# EAGLE design main_card_relay (EAGLE 6.3)
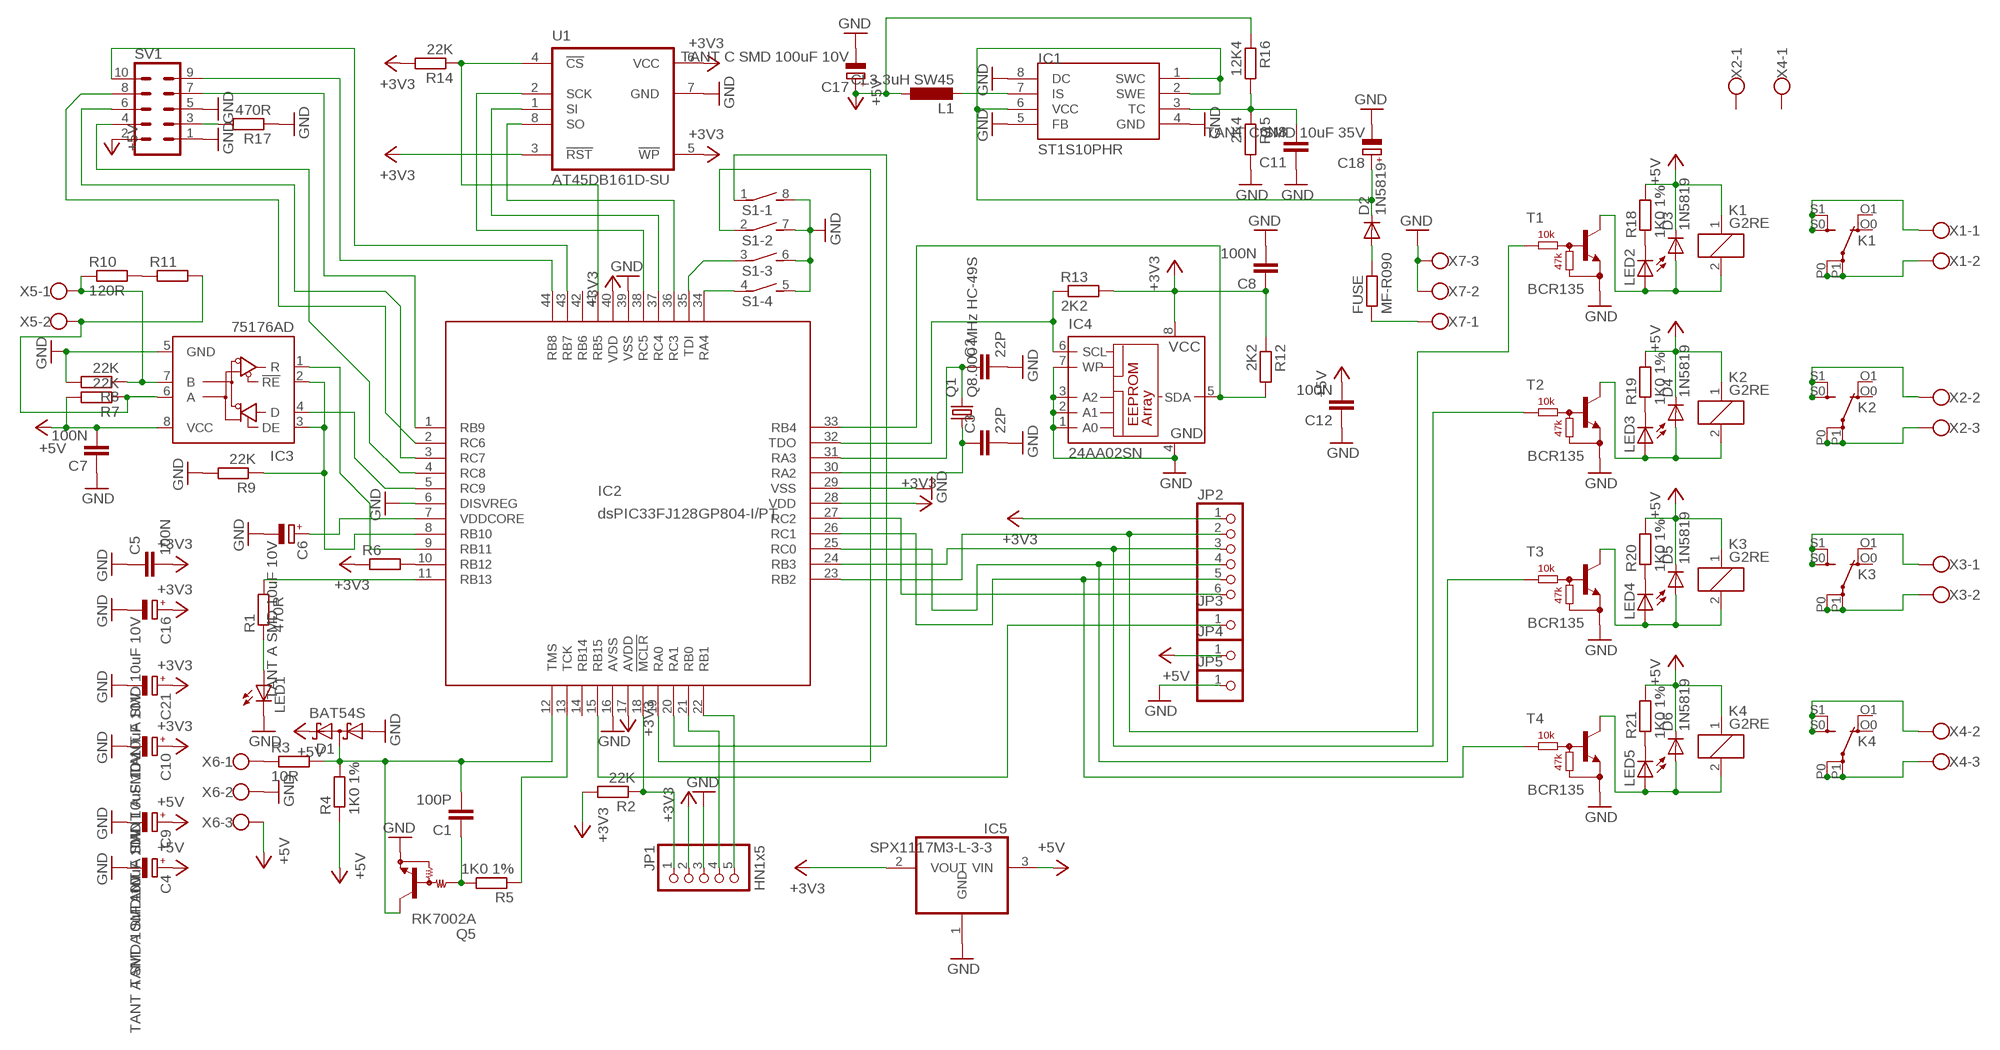
[diagram p0: schematic, sheet 1]

## Parts
C1  100P  C-EUC0805  [C0805]
C2  22P  C-EUC0805  [C0805]
C3  22P  C-EUC0805  [C0805]
C4  TANT A SMD 10uF 10V  CPOL-EUSMCA  [SMC_A]
C5  100N  C-EUC0805  [C0805]
C6  TANT A SMD 10uF 10V  CPOL-EUSMCA  [SMC_A]
C7  100N  C-EUC0805  [C0805]
C8  100N  C-EUC0805  [C0805]
C9  TANT A SMD 10uF 10V  CPOL-EUSMCA  [SMC_A]
C10  TANT A SMD 10uF 10V  CPOL-EUSMCA  [SMC_A]
C11  6N8  C-EUC0805  [C0805]
C12  100N  C-EUC0805  [C0805]
C16  TANT A SMD 10uF 10V  CPOL-EUSMCA  [SMC_A]
C17  TANT C SMD 100uF 10V  CPOL-EUSMCC  [SMC_C]
C18  TANT C SMD 10uF 35V  CPOL-EUSMCC  [SMC_C]
C21  TANT A SMD 10uF 10V  CPOL-EUSMCA  [SMC_A]
D1  BAT54S  BAS40-04  [SOT23]
D2  1N5819  DIODE-DO214AC  [DO214AC]
D3  1N5819  DIODE-DO214AC  [DO214AC]
D4  1N5819  DIODE-DO214AC  [DO214AC]
D5  1N5819  DIODE-DO214AC  [DO214AC]
D6  1N5819  DIODE-DO214AC  [DO214AC]
FUSE  MF-R090  R-EU_0204/2V  [0204V]
IC1  ST1S10PHR  MC34063AD  [SOIC8]
IC2  dsPIC33FJ128GP804-I/PT  PIC24FJ64GA004  [TQFP44]
IC3  75176AD  [D_R-PDSO-G8]
IC4  24AA02SN  [SO-08]
IC5  SPX1117M3-L-3-3  REG1117  [SOT223]
JP1  HN1x5  PINHD-1X5  [1X05]
JP2  PINHD-1X6  [1X06]
JP3  PINHD-1X1  [1X01]
JP4  PINHD-1X1  [1X01]
JP5  PINHD-1X1  [1X01]
K1  G2RE  [G2RE]
K2  G2RE  [G2RE]
K3  G2RE  [G2RE]
K4  G2RE  [G2RE]
L1  CL3.3uH SW45  L-EU0207/2V  [0207/2V]
LED1  LEDCHIPLED_1206  [CHIPLED_1206]
LED2  LEDCHIPLED_1206  [CHIPLED_1206]
LED3  LEDCHIPLED_1206  [CHIPLED_1206]
LED4  LEDCHIPLED_1206  [CHIPLED_1206]
LED5  LEDCHIPLED_1206  [CHIPLED_1206]
Q1  Q8.000 MHz HC-49S  CRYSTALHC49S  [HC49/S]
Q5  RK7002A  MUN2214T1  [SC59-BEC]
R1  470R  R-EU_R0805  [R0805]
R2  22K  R-EU_R0805  [R0805]
R3  10R  R-EU_R0805  [R0805]
R4  1K0 1%  R-EU_R0805  [R0805]
R5  1K0 1%  R-EU_R0805  [R0805]
R6  R-EU_R0201  [R0201]
R7  22K  R-EU_R0805  [R0805]
R8  22K  R-EU_R0805  [R0805]
R9  22K  R-EU_R0805  [R0805]
R10  120R  R-EU_R0805  [R0805]
R11  R-EU_R0201  [R0201]
R12  2K2  R-EU_R0805  [R0805]
R13  2K2  R-EU_R0805  [R0805]
R14  22K  R-EU_R0805  [R0805]
R15  2K4  R-EU_R0805  [R0805]
R16  12K4  R-EU_R0805  [R0805]
R17  470R  R-EU_R0805  [R0805]
R18  1K0 1%  R-EU_R0805  [R0805]
R19  1K0 1%  R-EU_R0805  [R0805]
R20  1K0 1%  R-EU_R0805  [R0805]
R21  1K0 1%  R-EU_R0805  [R0805]
S1  DIP04S  [DIP04S]
SV1  ML10  [ML10]
T1  BCR135  [SOT23-R_INFINEON]
T2  BCR135  [SOT23-R_INFINEON]
T3  BCR135  [SOT23-R_INFINEON]
T4  BCR135  [SOT23-R_INFINEON]
U1  AT45DB161D-SU  AT45DB011D-S  [SO08-8S2]
X1  W237-102  [W237-102]
X2  W237-103  [W237-103]
X3  W237-102  [W237-102]
X4  W237-103  [W237-103]
X5  W237-102  [W237-102]
X6  W237-103  [W237-103]
X7  W237-103  [W237-103]

## Nets
+3V3: C5.2 C8.1 C10.+ C16.+ C21.+ IC2.17(AVDD) IC2.28(VDD) IC2.40(VDD) IC4.8(VCC) IC5.2(VOUT) JP1.2 JP2.1 R2.2 R6.1 R12.1 R13.2 R14.2 U1.3(!RST!) U1.5(!WP!) U1.6(VCC)
+5V: C4.+ C7.2 C9.+ C12.2 C17.+ D1.2(C2) D3.C D4.C D5.C D6.C IC3.8(VCC) IC5.3(VIN) JP4.1 K1.1 K2.1 K3.1 K4.1 L1.1 R4.1 R7.2 R16.1 R18.2 R19.2 R20.2 R21.2 SV1.2 X6.3
GND: C2.2 C3.2 C4.- C5.1 C6.- C7.1 C8.2 C9.- C10.- C11.1 C12.1 C16.- C17.- C18.- C21.- D1.1(A1) IC1.4(GND) IC1.5(FB) IC1.8(DC) IC2.6(DISVREG) IC2.16(AVSS) IC2.29(VSS) IC2.39(VSS) IC3.5(GND) IC4.1(A0) IC4.2(A1) IC4.3(A2) IC4.4(GND) IC4.7(WP) IC5.1(GND) JP1.3 JP5.1 LED1.C Q5.E R8.2 R9.2 R15.2 R17.1 S1.5 S1.6 S1.7 S1.8 SV1.1 SV1.5 T1.2(E) T2.2(E) T3.2(E) T4.2(E) U1.7(GND) X6.2 X7.2 X7.3
N$1: C3.1 IC2.30(RA2) Q1.1
N$2: C2.1 IC2.31(RA3) Q1.2
N$3: IC2.11(RB13) R1.2
N$4: R3.1 X6.1
N$5: FUSE.1 X7.1
N$6: IC2.13(TCK) R5.1
N$7: IC2.10(RB12) R6.2
N$8: IC2.34(RA4) S1.4
N$9: IC2.36(RC3) U1.8(SO)
N$10: IC2.37(RC4) U1.1(SI)
N$11: IC2.38(RC5) U1.2(SCK)
N$12: C6.+ IC2.7(VDDCORE)
N$13: IC3.7(B) R8.1 R10.1 X5.1
N$14: IC3.6(A) R7.1 R11.2 X5.2
N$15: IC2.8(RB10) IC3.2(!RE) IC3.3(DE) R9.1
N$16: IC2.5(RC9) IC3.4(D)
N$17: IC2.9(RB11) IC3.1(R)
N$18: R10.2 R11.1
N$19: IC2.33(RB4) IC4.5(SDA) R12.2
N$20: R17.2 SV1.3
N$21: IC2.35(TDI) S1.3
N$22: IC2.32(TDO) IC4.6(SCL) R13.1
N$23: IC2.44(RB8) SV1.9
N$24: IC2.41(RB5) R14.1 U1.4(!CS!)
N$25: IC2.43(RB7) SV1.10
N$26: IC2.4(RC8) SV1.4
N$27: C1.2 D1.3(C1A2) IC2.12(TMS) Q5.C R3.2 R4.2
N$28: C1.1 Q5.B R5.2
N$29: IC2.18(!MCLR) JP1.1 R2.1
N$30: IC2.3(RC7) SV1.6
N$31: IC2.2(RC6) SV1.8
N$32: IC2.21(RB0) JP1.4
N$33: IC2.22(RB1) JP1.5
N$34: LED2.C R18.1
N$35: IC2.1(RB9) SV1.7
N$36: IC2.19(RA0) S1.2
N$37: IC2.20(RA1) S1.1
N$38: IC2.24(RB3) JP2.3 T2.1(B)
N$39: D3.A K1.2 LED2.A T1.3(C)
N$40: K1.P0(2:P) K1.P1(2:P) X1.2
N$41: IC2.27(RC2) JP2.6
N$42: K1.S0(2:S) K1.S1(2:S) X1.1
N$43: IC2.23(RB2) JP2.2 T1.1(B)
N$44: IC2.25(RC0) JP2.4 T3.1(B)
N$45: LED3.C R19.1
N$46: D4.A K2.2 LED3.A T2.3(C)
N$47: IC2.26(RC1) JP2.5 T4.1(B)
N$48: K2.P0(2:P) K2.P1(2:P) X2.3
N$49: K2.S0(2:S) K2.S1(2:S) X2.2
N$50: LED4.C R20.1
N$51: D5.A K3.2 LED4.A T3.3(C)
N$52: IC2.15(RB15) JP3.1
N$53: K3.P0(2:P) K3.P1(2:P) X3.2
N$54: D2.A FUSE.2
N$55: K3.S0(2:S) K3.S1(2:S) X3.1
N$56: LED5.C R21.1
N$57: D6.A K4.2 LED5.A T4.3(C)
N$58: C18.+ D2.C IC1.1(SWC) IC1.2(SWE) IC1.6(VCC)
N$59: K4.P0(2:P) K4.P1(2:P) X4.3
N$60: K4.S0(2:S) K4.S1(2:S) X4.2
N$61: IC1.7(IS) L1.2
N$63: C11.2 IC1.3(TC) R15.1 R16.2
N$64: LED1.A R1.1
Unconnected: IC2.14(RB14) IC2.42(RB6) K1.O0(2:O) K1.O1(2:O) K2.O0(2:O) K2.O1(2:O) K3.O0(2:O) K3.O1(2:O) K4.O0(2:O) K4.O1(2:O) X2.1 X4.1

## Library data of the parts
C1-C3 C5 C7 C8 C11 C12 = rcl:C-EU: CAPACITOR, European symbol
C4 C6 C9 C10 C16-C18 C21 = rcl:CPOL-EU: POLARIZED CAPACITOR, European symbol
D1 = diode:BAS40-04: Silicon Schottky Diodes General-purpose diode for high-speed switching
D2-D6 = _mod_diode:DIODE-: DIODE
FUSE R1-R21 = rcl:R-EU_: RESISTOR, European symbol
IC1 = mc34063:MC34063
IC2 = microchip-6:PIC24FJ64GA004: PIC24FJ64GA004 edit this description Auto generated by make-symbol-device-package-bsdl.ulp Rev. 25 Source: PIC24FJ64GA004.bsd
IC3 = 751xx:75176A: DIFFERENTIAL BUS TRANSCEIVER Source: http://focus.ti.com/lit/ds/symlink/sn75176a.pdf
IC4 = microchip:24*: Serial EEPROM I2C; MPN: 24AA02/SN; OC_FARNELL: 1331272; OC_NEWARK: 89C9793
IC5 = burr-brown:REG1117: 800mA and 1A Low Dropout (LDO) Positive Regulator 1.8V, 2.5V, 2.85V, 3.3V, 5V, and Adj; MPN: REG1117; OC_FARNELL: 1097566; OC_NEWARK: 14P6981
JP1 = pinhead:PINHD-1X5: PIN HEADER
JP2 = pinhead:PINHD-1X6: PIN HEADER
JP3-JP5 = pinhead:PINHD-1X1: PIN HEADER
K1-K4 = relay:G2RE: RELAY 1 x switch, high current, Omron; OC_FARNELL: unknown; OC_NEWARK: unknown
L1 = rcl:L-EU: INDUCTOR, European symbol
LED1-LED5 = led:LED: LED OSRAM: - CHIPLED LG R971, LG N971, LY N971, LG Q971, LY Q971, LO R971, LY R971 LH N974, LH R974 LS Q976, LO Q976, LY Q976 LO Q996 - Hyper CHIPLED LW Q18S LB Q993, LB Q99A, LB R99A - SideLED LS A670, LO A670, LY A670, LG A670, LP A670 LB A673, LV A673, LT A673, LW A673 LH A674 LY A675 LS A676, LA A676, LO A676, LY A676, LW A676 LS A679, LY A679, LG A679 - Hyper Micro SIDELED® LS Y876, LA Y876, LO Y876, LY Y876 LT Y87S - SmartLED LW L88C, LW L88S LB L89C, LB L89S, LG L890 LS L89K, LO L89K, LY L89K LS L896, LA L896, LO L896, LY L896 - TOPLED LS T670, LO T670, LY T670, LG T670, LP T670 LSG T670, LSP T670, LSY T670, LOP T670, LYG T670 LG T671, LOG T671, LSG T671 LB T673, LV T673, LT T673, LW T673 LH T674 LS T676, LA T676, LO T676, LY T676, LB T676, LH T676, LSB T676, LW T676 LB T67C, LV T67C, LT T67C, LS T67K, LO T67K, LY T67K, LW E67C LS E67B, LA E67B, LO E67B, LY E67B, LB E67C, LV E67C, LT E67C LW T67C LS T679, LY T679, LG T679 LS T770, LO T770, LY T770, LG T770, LP T770 LB T773, LV T773, LT T773, LW T773 LH T774 LS E675, LA E675, LY E675, LS T675 LS T776, LA T776, LO T776, LY T776, LB T776 LHGB T686 LT T68C, LB T68C - Hyper Mini TOPLED® LB M676 - Mini TOPLED Santana® LG M470 LS M47K, LO M47K, LY M47K Source: http://www.osram.convergy.de LUXEON: - LUMILED® LXK2-PW12-R00, LXK2-PW12-S00, LXK2-PW14-U00, LXK2-PW14-V00 LXK2-PM12-R00, LXK2-PM12-S00, LXK2-PM14-U00 LXK2-PE12-Q00, LXK2-PE12-R00, LXK2-PE12-S00, LXK2-PE14-T00, LXK2-PE14-U00 LXK2-PB12-K00, LXK2-PB12-L00, LXK2-PB12-M00, LXK2-PB14-N00, LXK2-PB14-P00, LXK2-PB14-Q00 LXK2-PR12-L00, LXK2-PR12-M00, LXK2-PR14-Q00, LXK2-PR14-R00 LXK2-PD12-Q00, LXK2-PD12-R00, LXK2-PD12-S00 LXK2-PH12-R00, LXK2-PH12-S00 LXK2-PL12-P00, LXK2-PL12-Q00, LXK2-PL12-R00 Source: www.luxeon.com KINGBRIGHT: KA-3528ASYC Source: www.kingbright.com
Q1 = crystal:CRYSTAL: CRYSTAL; OC_FARNELL: 1667008; OC_NEWARK: unknown
Q5 = transistor-npn:MUN2214*: NPN Bias Resistor Transistor
S1 = switch-dil:DIP04S: DIL/CODE SWITCH
SV1 = con-harting-ml:ML10: HARTING; OC_FARNELL: unknown; OC_NEWARK: unknown
T1-T4 = digital-transistors-1:BCR135: NPN Silicon Digital Transistor 50V 0,1A 0,2W
U1 = memory-atmel:AT45DB011D: DataFlash RapidS Serial Interface, 66 MHZ
X1 X3 X5 = con-wago-500:W237-102: WAGO SCREW CLAMP; MPN: 237-102; OC_FARNELL: unknown; OC_NEWARK: 70K9898
X2 X4 X6 X7 = con-wago-500:W237-103: WAGO SCREW CLAMP; MPN: 237-103; OC_FARNELL: unknown; OC_NEWARK: 18M7116

## Board
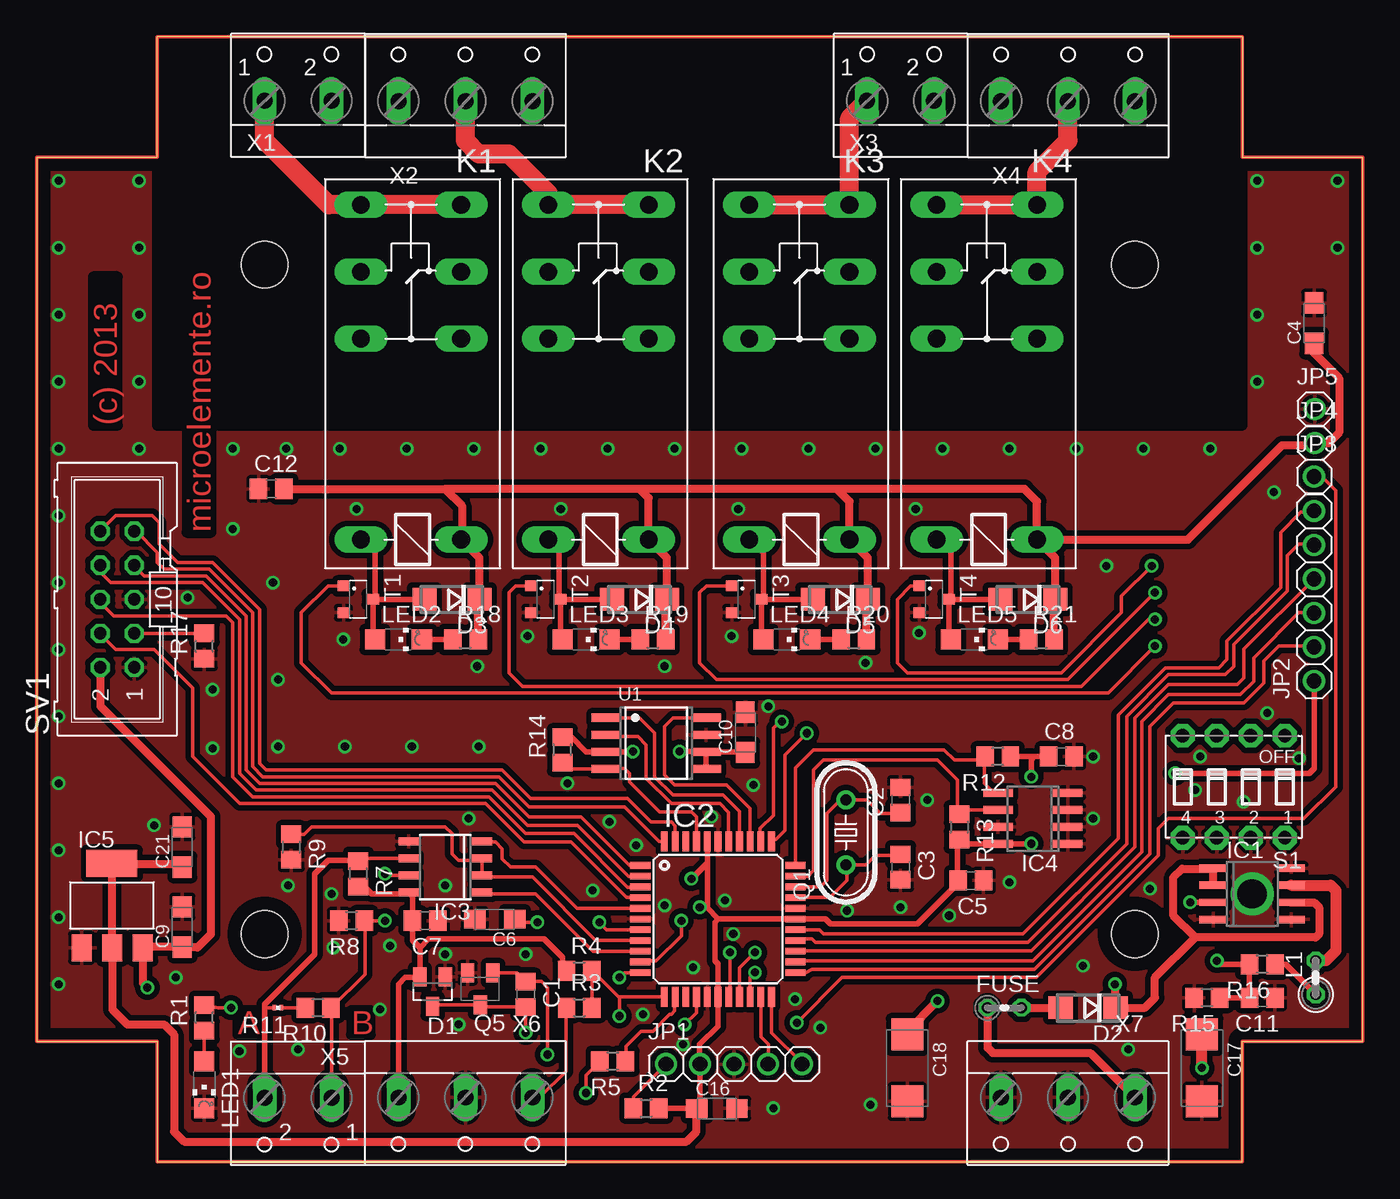
[diagram p1: board, top side]
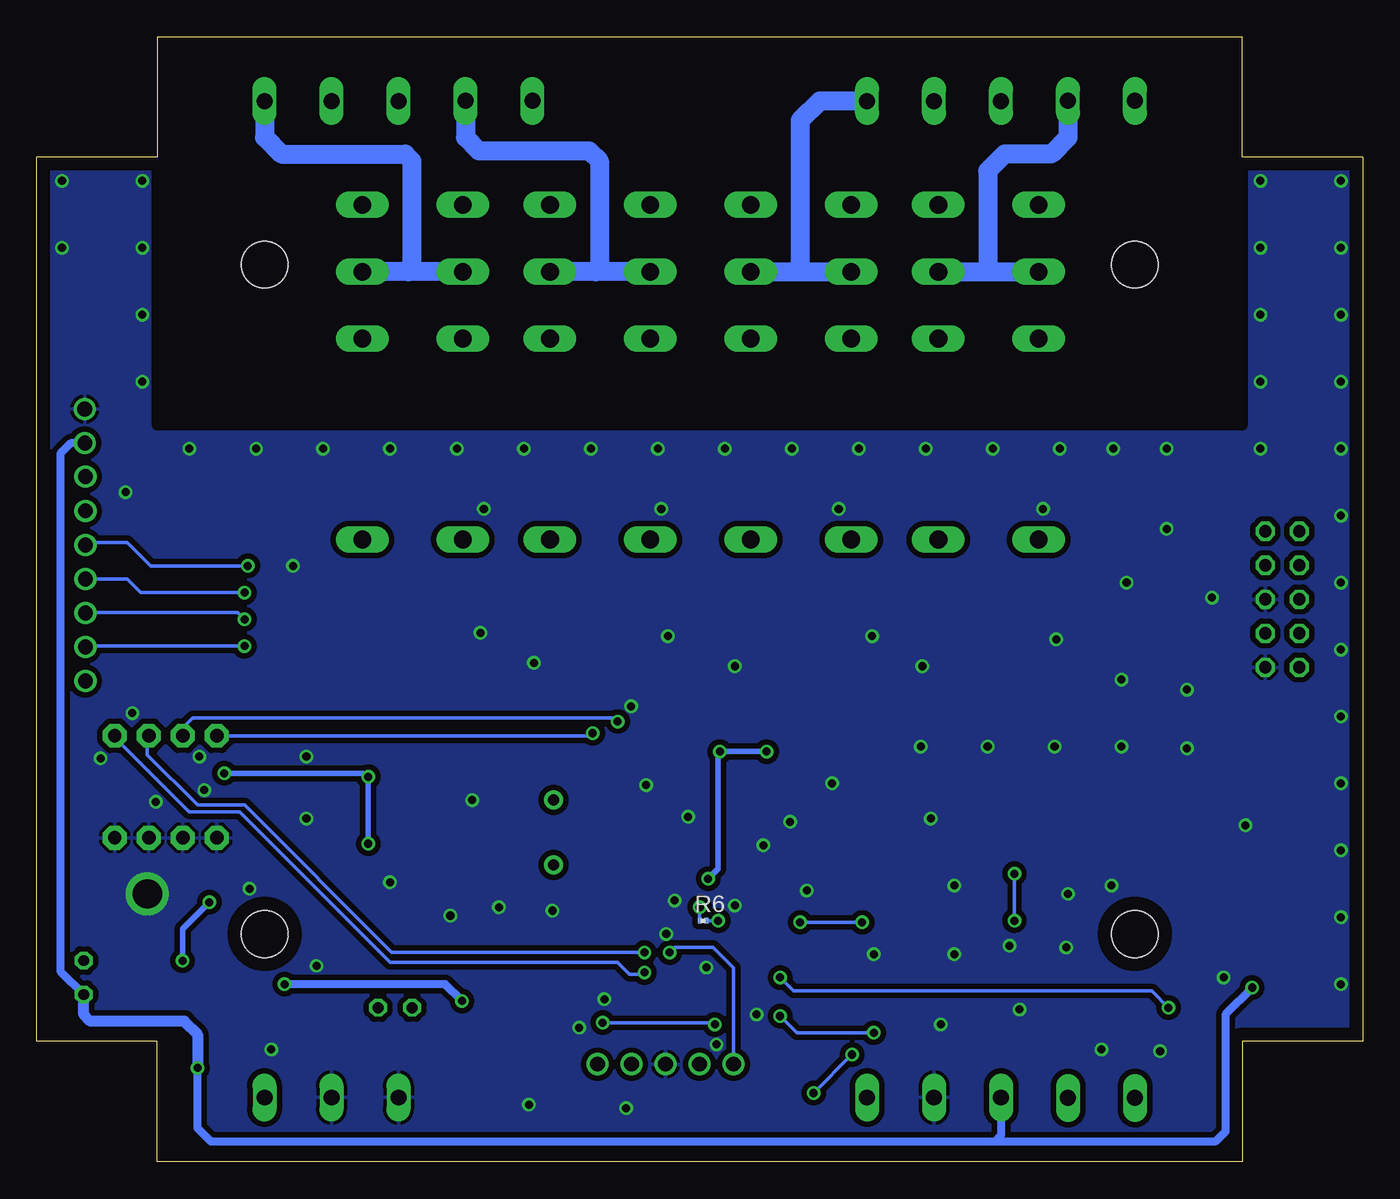
[diagram p2: board, bottom side, seen from below]

Size 99 x 84 mm. Coordinates in mm from the lower left corner, seen from the top.
Outline: 9,0 90,0 90,9 99,9 99,75 90,75 90,84 9,84 9,75 0,75 0,9 9,9 9,0
Copper layers (1*16): Top 0.035mm / dielectric 1.5mm / Bottom 0.035mm
Design rules "default": minimum track width 10mil, minimum drill 24mil, track to track 8mil, track to pad 8mil, pad to pad 8mil, via to via 8mil, smd to smd 8mil, copper to edge 40mil, drill to drill 8mil, minimum pad ring 10mil, minimum via ring 8mil, stop-mask expansion 4mil, vias tented up to drill 0mil, thermal gap 10mil
Holes 3.5 mm at 17,67 17,17 82,67 82,17
tRestrict: area 9,55 to 90,84
bRestrict: area 9,55 to 90,84

### Footprints (pad centres in the part's own frame; a part is rotated, then mirrored left to right if it is on the bottom)
C0805 = smd 1.3 x 1.5: 1 -0.95,0; 2 0.95,0
SMC_A = smd 1.6 x 1.4: + -1.5,0; - 1.5,0
SMC_C = smd 2.4 x 2.4: + -2.5,0; - 2.5,0
SOT23 = smd 1 x 1.4: 1 -0.95,-1.1; 2 0.95,-1.1; 3 0,1.1
DO214AC = smd 1.8 x 1.7: A 2.05,0; C -2.05,0
0204V = drill 0.813 octagon: 1 -1.27,0; 2 1.27,0
SOIC8 = smd 0.559 x 2.032: 1 -1.905,-2.917; 2 -0.635,-2.917; 3 0.635,-2.917; 4 1.905,-2.917; 5 1.905,2.917; 6 0.635,2.917; 7 -0.635,2.917; 8 -1.905,2.917
TQFP44 = smd 1.5 x 0.5: 1 -5.8,4; 2 -5.8,3.2; 3 -5.8,2.4; 4 -5.8,1.6; 5 -5.8,0.8; 6 -5.8,0; 7 -5.8,-0.8; 8 -5.8,-1.6; 9 -5.8,-2.4; 10 -5.8,-3.2; 11 -5.8,-4; 23 5.8,-4; 24 5.8,-3.2; 25 5.8,-2.4; 26 5.8,-1.6; 27 5.8,-0.8; 28 5.8,0; 29 5.8,0.8; 30 5.8,1.6; 31 5.8,2.4; 32 5.8,3.2; 33 5.8,4 | smd 0.5 x 1.5: 12 -4,-5.8; 13 -3.2,-5.8; 14 -2.4,-5.8; 15 -1.6,-5.8; 16 -0.8,-5.8; 17 0,-5.8; 18 0.8,-5.8; 19 1.6,-5.8; 20 2.4,-5.8; 21 3.2,-5.8; 22 4,-5.8; 34 4,5.8; 35 3.2,5.8; 36 2.4,5.8; 37 1.6,5.8; 38 0.8,5.8; 39 0,5.8; 40 -0.8,5.8; 41 -1.6,5.8; 42 -2.4,5.8; 43 -3.2,5.8; 44 -4,5.8
D_R-PDSO-G8 = smd 0.6 x 1.5: 1 -1.905,-2.75; 2 -0.635,-2.75; 3 0.635,-2.75; 4 1.905,-2.75; 5 1.905,2.75; 6 0.635,2.75; 7 -0.635,2.75; 8 -1.905,2.75
SO-08 = smd 0.6 x 2.2: 1 -1.905,-2.6; 2 -0.635,-2.6; 3 0.635,-2.6; 4 1.905,-2.6; 5 1.905,2.6; 6 0.635,2.6; 7 -0.635,2.6; 8 -1.905,2.6
SOT223 = smd 1.499 x 2.007: 1 -2.261,-3.15; 2 0.025,-3.15; 3 2.311,-3.15 | smd 3.81 x 2.007: 4 0,3.15
1X05 = drill 1.1: 1 -5.08,0; 2 -2.54,0; 3 0,0; 4 2.54,0; 5 5.08,0
1X06 = drill 1.1: 1 -6.35,0; 2 -3.81,0; 3 -1.27,0; 4 1.27,0; 5 3.81,0; 6 6.35,0
1X01 = drill 1.1: 1 0,0
G2RE = drill 1.321 long: 1 -2.54,-3.683; 2 -2.54,3.81; O0 12.471,-3.683; O1 12.471,3.81; P0 17.45,-3.683; P1 17.45,3.81; S0 22.454,-3.683; S1 22.454,3.81
0207/2V = drill 0.813 octagon: 1 -1.27,0; 2 1.27,0
CHIPLED_1206 = smd 1.5 x 1.5: A 0,-1.75; C 0,1.75
HC49/S = drill 0.813 pad 1.422: 1 -2.413,0; 2 2.413,0
SC59-BEC = smd 1 x 1.4: B -0.95,-1.2; C 0,1.2; E 0.95,-1.2
R0805 = smd 1.3 x 1.5: 1 -0.95,0; 2 0.95,0
R0201 = smd 0.28 x 0.43: 1 -0.255,0; 2 0.255,0
DIP04S = drill 1 pad 1.778 octagon: 1 -3.81,-3.81; 2 -1.27,-3.81; 3 1.27,-3.81; 4 3.81,-3.81; 5 3.81,3.81; 6 1.27,3.81; 7 -1.27,3.81; 8 -3.81,3.81
ML10 = drill 0.914 octagon: 1 -5.08,-1.27; 2 -5.08,1.27; 3 -2.54,-1.27; 4 -2.54,1.27; 5 0,-1.27; 6 0,1.27; 7 2.54,-1.27; 8 2.54,1.27; 9 5.08,-1.27; 10 5.08,1.27
SOT23-R_INFINEON = smd 0.8 x 0.9: 1 -1,-1.1; 2 1,-1.1; 3 0,1.1
SO08-8S2 = smd 0.6 x 2.2: 1 -1.905,-3.725; 2 -0.635,-3.725; 3 0.635,-3.725; 4 1.905,-3.725; 5 1.905,3.725; 6 0.635,3.725; 7 -0.635,3.725; 8 -1.905,3.725
W237-102 = drill 1.194 long: 1 -2.5,-1.27; 2 2.5,-1.27
W237-103 = drill 1.194 long: 1 -5,-1.29; 2 0,-1.29; 3 5,-1.29

### Placement (x,y rotation side)
C1  36.5,12.5 270 top
C2  64.5,27 90 top
C3  64.5,22 270 top
C4  95.38,62.62 90 top
C5  69.75,21 180 top
C6  34.19,18.11 180 top
C7  29,18 180 top
C8  76.5,30.25 0 top
C9  10.86,17.53 90 top
C10  52.91,32.06 90 top
C11  91.5,12.25 180 top
C12  17.5,50.25 0 top
C16  50.78,3.97 0 top
C17  87,7 270 top
C18  65,7 270 top
C21  10.86,23.5 90 top
D1  29.55,12.71 180 top
D2  78.5,11.5 180 top
D3  31,42 180 top
D4  45,42 180 top
D5  60,42 180 top
D6  74,42 180 top
FUSE  72.25,11.5 0 top
IC1  90.75,20 270 top
IC2  50.86,18.12 0 top
IC3  30.5,22 90 top
IC4  74.38,25.62 90 top
IC5  5.6,19.13 0 top
JP1  52.06,7.29 0 top
JP2  95.38,42.25 90 top
JP3  95.38,51.16 0 top
JP4  95.42,53.66 0 top
JP5  95.42,56.2 0 top
K1  28,49 90 top
K2  42,49 90 top
K3  57,49 90 top
K4  71,49 90 top
L1  95.5,13.75 90 top
LED1  12.5,5.75 180 top
LED2  27,39 270 top
LED3  41,39 270 top
LED4  56,39 270 top
LED5  70,39 270 top
Q1  60.41,24.59 90 top
Q5  33.11,12.91 180 top
R1  12.5,10.75 90 top
R2  45.5,4 0 top
R3  40.5,11.5 0 top
R4  40.5,14.25 0 top
R5  43,7.5 180 top
R6  49.25,18 0 bottom
R7  24,21.5 270 top
R8  23.5,18 180 top
R9  19,23.5 270 top
R10  21,11.5 180 top
R11  18,11.5 180 top
R12  71.75,30.25 180 top
R13  68.88,25 270 top
R14  39.25,30.75 90 top
R15  87.38,12.25 180 top
R16  91.5,14.75 180 top
R17  12.5,38.5 90 top
R18  32,39 0 top
R19  46,39 0 top
R20  61,39 0 top
R21  75,39 0 top
S1  89.38,28 180 top
SV1  6,42 90 top
T1  24,42 270 top
T2  38,42 270 top
T3  53,42 270 top
T4  67,42 270 top
U1  46.25,31.25 270 top
X1  19.5,80.5 0 top
X2  32,80.5 0 top
X3  64.5,80.5 0 top
X4  77,80.5 0 top
X5  19.5,3.5 180 top
X6  32,3.5 180 top
X7  77,3.5 180 top

### Tracks (layer width: path | path; a pad name or v marks a point on that pad's centre or on a via)
+3V3  (via drill 0.6)
  Top 0.254: v49.5,19 50.06,19 | C5.2 68.75,21
  Top 0.406: 50.88,18.12 50.06,18.94 50.06,19 IC2.40 50.06,22.31 v48.88,21.12 | 50.88,18.12 IC2.28 58.88,18.12 59.25,17.75 65.75,17.75 68.75,20.75 68.75,21 68.75,23.93 R13.2 | 50.88,18.12 50.62,17.88 50.62,15 50.86,14.77 IC2.17 50.86,10.11 49.5,8.75 49.5,7.31 JP1.2 49.52,4.21 C16.+ 46.48,3.97 R2.2 | C8.1 74.5,30.25 | 74.5,30.25 R12.1 | R13.2 69.2,23.72 IC4.8 74.22,23.72 v74.25,23.75 | R13.2 68.55,24.05 | v74.25,28.75 74.25,30 74.5,30.25 | 50.06,29.26 U1.5 U1.6 | R14.2 39.3,31.75 39.88,31.75 41.01,30.61 U1.3 v44.49,30.61 v44.5,30.62 | v48,30.62 49.97,30.62 U1.6 | U1.6 52.85,30.61 C10.+ | JP2.1 95.38,29.38 95,29 v85,29
  Top 0.61: IC5.2 5.62,11.38 6.75,10.25 9.5,10.25 10.25,9.5 10.25,2.25 11,1.5 48.5,1.5 49.25,2.25 49.25,3.94 C16.+ | IC5.2 | IC5.2 5.62,22.25 10.86,22.25 C21.+
  Bottom 0.254: R6.1 v49.51,19 v49.5,19
  Bottom 0.406: v74.25,23.75 v74.25,28.75 74.5,29 v85,29 | v44.5,30.62 v48,30.62 48.12,30.5 48.12,21.88 v48.88,21.12
+5V  (via drill 0.6)
  Top 0.406: X6.3 27,13.25 27.5,13.75 28.54,13.75 D1.2 28.6,15.97 | 28.6,15.97 29.25,16.62 37.88,16.62 39.25,15.25 39.25,13.8 R4.1 | L1.1 95.5,12.5 93.25,14.75 R16.1 | 28.6,15.97 28.05,16.52 C7.2 28.05,19.8 IC3.8 27.66,20 25,20 24.45,20.55 R7.2
  Top 0.61: v8.25,13 7.91,13.34 IC5.3 7.96,16.03 C9.+ 10.89,16 12,16 13,17 13,25.75 4.75,34 4.75,36.9 SV1.2 | C4.+ 95.38,60.38 97.25,58.5 97.25,54.45 96.46,53.66 JP4.1 | 95.33,53.75 JP4.1 | C12.2 30.5,50.25 | 30.5,50.25 31.75,49 31.75,46.53 K1.1 33.05,45.09 D3.C 32.95,41.9 R18.2 | 45,50.25 45.68,49.57 K2.1 47.05,45.09 D4.C 46.95,41.9 R19.2 | 45,50.25 30.5,50.25 | 59.75,50.25 60.68,49.32 K3.1 62.05,45.09 D5.C 61.95,41.9 R20.2 | 59.75,50.25 45,50.25 | K4.1 74.68,49.32 73.75,50.25 59.75,50.25 | K4.1 85.96,46.46 93,53.5 95.25,53.5 JP4.1 | R21.2 75.95,41.9 D6.C 76.05,45.09 K4.1
  Top 0.813: v87,7 C17.+
  Bottom 0.61: X6.3 27,2 27.5,1.5 | 27.5,1.5 86,1.5 87,2.5 v87,7 | v8.25,13 10.25,11 10.25,2.25 11,1.5 27.5,1.5 | JP4.1 96.46,53.66 97.25,52.88 97.25,14.23 L1.1
  Bottom 0.813: v87,7 C17.+ 88,10.5 95,10.5 95.5,11 L1.1
GND  (via drill 0.6, 2.2)
  other vias: 30.5,15.5 36.5,15.5 31.5,10.25 49,14.5 48.25,8.75 45.25,11 19.5,8.38 60.5,18.75 64.5,19 66.5,27 51.38,19.5 52,17 90.75,20 46.88,19.12 50.38,25.75 53.5,28.12 44.75,23.62 42.75,25.38 39.62,28.25 41.5,20.25 30.5,20.62 26.38,16.12 22,20 22.12,16 25.62,11.38 15.12,8.25 10.38,13.75 32.25,25.62 18.75,20.62 11.25,42.12 68.12,18.38 72.62,20.88 56.62,12.12 78.12,14.62 81.5,8.38 83.12,20.38 78.88,25.62 78.88,30.25 86.88,30.25 94.25,30.12 91.88,33.5 86.5,27.75 90.12,26.88 58.5,10 8.75,25.12 13.12,35.25 13.12,30.88 18,31 54.62,34 97.12,73.25 91.12,73.25 1.62,73.25 7.62,73.25 1.62,68.25 1.62,63.25 1.62,58.25 1.62,53.25 1.62,48.25 1.62,43.25 1.62,38.25 1.62,33.25 1.62,28.25 1.62,23.25 1.62,18.25 1.62,13.25 62.25,4.25 55,4 7.62,68.25 7.62,63.25 7.62,58.25 7.62,53.25 14.62,53.25 18.62,53.25 22.62,53.25 27.62,53.25 32.62,53.25 37.62,53.25 42.62,53.25 47.62,53.25 52.62,53.25 57.62,53.25 62.62,53.25 67.62,53.25 72.62,53.25 77.62,53.25 82.62,53.25 87.62,53.25 91.12,68.25 91.12,63.25 91.12,58.25 97.12,68.25 65.88,39.5 51.88,39.25 65.62,48.75 52.38,48.75 79.88,44.5 92.38,50 39.12,48.75 36.62,39.25 22.88,39 23.88,48.75 23,31 28,31 33,31 14.62,47.25 17.62,43.25 18,36 32.88,37 46.88,37 61.88,37.25
  pour Top (isolate 0.406): 9,0 90,0 90,9 99,9 99,75 90,75 90,84 9,84 9,75 8,75 0,75 0,9 9,9
  pour Bottom (isolate 0.406): 9,0 90,0 90,9 99,9 99,75 90,75 90,84 9,84 9,75 0,75 0,9 9,9
N$1
  Top 0.254: Q1.1 61.93,22.18 62.62,22.88 64.42,22.88 C3.1 | 60.36,22.12 Q1.1 | IC2.30 59.22,19.72 60.5,21 60.5,22.09 Q1.1
N$2
  Top 0.254: C2.1 64.45,26 63,26 62,27 Q1.2 60,27 59,26 59,21 58.52,20.52 IC2.31
N$3  (via drill 0.6)
  Top 0.254: IC2.11 43.87,14.12 v43.5,13.75 | v14.5,11.5 13.55,11.5 R1.2
  Bottom 0.254: v43.5,13.75 42.5,12.75 15.75,12.75 v14.5,11.5
N$4
  Top 0.254: X6.1 37.54,4.79 39.5,6.75 39.5,10.95 R3.1
N$5
  Top 0.61: FUSE.1 71,10.98 71,8.5 71.38,8.12 78.67,8.12 X7.1
N$6
  Top 0.254: R5.1 44,7.55 44,8.62 45.12,9.75 46,9.75 47.25,11 47.38,11 47.62,11.25 47.62,12.29 IC2.13
N$7  (via drill 0.6)
  Top 0.254: v48.12,18 48.12,16.88 46.25,15 45.14,15 IC2.10
  Bottom 0.254: R6.2 v48.12,18
N$8  (via drill 0.6)
  Top 0.254: IC2.34 55,24.06 55.19,24.06 55.88,24.75 55.88,30.38 v57.5,32
  Bottom 0.254: S1.4 57.69,31.81 v57.5,32
N$9
  Top 0.254: 50.07,33.25 U1.8 49.95,33.12 47.5,33.12 46.88,32.5 46.88,28.88 47.62,28.12 51.5,28.12 53.26,26.36 IC2.36
N$10
  Top 0.254: IC2.37 52.46,26.16 51.25,27.38 47.5,27.38 46.12,28.75 46.12,32 45,33.12 42.55,33.12 U1.1
N$11
  Top 0.254: IC2.38 51.66,26.09 51,26.75 47.38,26.75 45.5,28.62 45.5,31.12 44.88,31.75 42.66,31.75 U1.2
N$12  (via drill 0.6)
  Top 0.254: IC2.7 42.55,17.32 v42,17.88 | v37.38,17.88 35.92,17.88 C6.+
  Bottom 0.254: v42,17.88 v37.38,17.88
N$13  (via drill 0.6)
  Top 0.254: IC3.7 26.14,21.36 v26,21.5 | v26,18 R8.1 24.5,17.95 24.5,14 21.95,11.45 R10.1 22,10.95 X5.1
  Bottom 0.254: v26,21.5 v26,18
N$14
  Top 0.254: IC3.6 24.18,22.64 R7.1 | R11.2 17,11.5
  Top 0.406: X5.2 17,11.5 17,11.75 20.75,15.5 20.75,21.5 21.75,22.5 23.95,22.5 R7.1
N$15
  Top 0.254: IC2.8 41.73,16.52 37,21.25 33.37,21.25 IC3.2 IC3.3 33.12,22.5 31.5,22.5 31,23 31,24.5 30.5,25 20.5,25 19.95,24.45 R9.1
N$16
  Top 0.254: IC2.5 40.33,18.92 37.25,22 35.38,22 34.75,22.62 34.75,23.38 34.25,23.88 33.28,23.88 IC3.4
N$17
  Top 0.254: IC2.9 41.53,15.72 37.25,20 33.34,20 IC3.1
N$18
  Top 0.254: R11.1 R10.2
N$19
  Top 0.254: IC4.5 71.47,27.53 70.75,28.25 70.75,30.2 R12.2 70.55,30 68.5,30 67.75,30.75 58,30.75 56.66,29.41 IC2.33
N$20
  Top 0.254: SV1.3 R17.2
N$21  (via drill 0.6)
  Top 0.254: IC2.35 54,23.98 54,24.88 55,25.88 55,32.38 55.5,32.88 v55.62,32.88
  Bottom 0.254: S1.3 88.11,32.4 87.38,33.12 55.88,33.12 v55.62,32.88
N$22
  Top 0.254: IC4.6 69.19,26.26 R13.1 68.75,26.07 68.75,28.5 67.25,30 58.75,30 58,29.25 58,21.75 57.57,21.32 IC2.32
N$23
  Top 0.254: IC2.44 46.45,23.92 43.88,26.5 36.75,26.5 34.5,28.75 16.88,28.75 16.12,29.5 16.12,41 12.88,44.25 9.5,44.25 9,44.75 9,45.5 7.42,47.08 SV1.9
N$24
  Top 0.254: IC2.41 49.26,25.74 48.88,26.12 46.5,26.12 44.25,28.38 44.25,29 43.88,29.38 42.55,29.38 U1.4 39.7,29.34
  Top 0.406: 39.7,29.34 R14.1
N$25
  Top 0.254: IC2.43 47.66,25.09 47.38,25.38 45.88,25.38 44.12,27.12 36.88,27.12 34.75,29.25 17.12,29.25 16.62,29.75 16.62,41.25 13.12,44.75 10.5,44.75 9.12,46.12 9.12,47.75 8.62,48.25 5.9,48.25 SV1.10
N$26
  Top 0.254: IC2.4 44.03,19.72 39.88,23.88 36.38,23.88 33.62,26.62 33.5,26.75 15.12,26.75 11.62,30.25 11.62,35.38 8.75,38.25 5.88,38.25 4.73,39.4 SV1.4
N$27  (via drill 0.6)
  Top 0.254: IC2.12 43.62,12.32 | 43.62,12.32 43.43,12.32 42.25,13.5 R4.2 R3.2 | D1.3 29.65,11.71 Q5.C 33.27,11.55 C1.2 v36.5,9.62 | v43.5,10.88 43.5,12.2 43.62,12.32
  Bottom 0.254: v36.5,9.62 42.25,9.62 v43.5,10.88
N$28  (via drill 0.6)
  Top 0.254: Q5.B 35.84,14.11 C1.1 37.67,13.45 38.12,13 v38.12,8 | v41,5.12 41,6.45 R5.2
  Bottom 0.254: v38.12,8 v41,5.12
N$29  (via drill 0.6)
  Top 0.254: R2.1 44.55,4.86 JP1.1 | v51.75,15.62 51.75,12.41 IC2.18
  Bottom 0.254: JP1.1 46.98,14.48 48.5,16 51.38,16 v51.75,15.62
N$30
  Top 0.254: IC2.3 45.04,20.5 44.12,20.5 40.12,24.5 36.5,24.5 33.75,27.25 16.12,27.25 14.62,28.75 14.62,40.25 14.12,40.75 5.75,40.75 4.73,41.77 SV1.6
N$31
  Top 0.254: IC2.2 44.18,21.32 40.38,25.12 36.62,25.12 34,27.75 16.38,27.75 15.12,29 15.12,40.5 12.38,43.25 5.5,43.25 4.73,44.02 SV1.8
N$32
  Top 0.254: IC2.21 54.06,9.31 54.62,8.75 54.62,7.32 JP1.4
N$33
  Top 0.254: IC2.22 54.86,9.64 57.12,7.38 57.12,7.3 JP1.5
N$34
  Top 0.406: LED2.C R18.1
N$35
  Top 0.254: IC2.1 44.26,22.12 40.62,25.75 36.75,25.75 34.25,28.25 16.62,28.25 15.62,29.25 15.62,40.75 12.62,43.75 8,43.75 7.27,44.48 SV1.7
N$36  (via drill 0.6)
  Top 0.254: IC2.19 52.46,14.46 v53.62,15.62
  Bottom 0.254: v53.62,15.62 72.5,15.62 83.5,26.62 87,26.62 90.75,30.38 90.75,31.7 S1.2
N$37  (via drill 0.6)
  Top 0.254: v53.62,14.12 53.25,13.75 IC2.20
  Bottom 0.254: S1.1 93.19,31.68 87.62,26.12 83.88,26.12 72.62,14.88 55.62,14.88 54.75,14 53.75,14 v53.62,14.12
N$38  (via drill 0.6)
  Top 0.254: JP2.3 95.36,41 94.25,41 90.88,37.62 90.88,35.88 89.88,34.88 84.5,34.88 82.5,32.88 82.5,23.12 74.38,15 56.74,15 IC2.24 | T2.1 35.75,43 35.25,42.5 35.25,36.5 36.25,35.5 78,35.5 83,40.5 v83.5,40.5
  Bottom 0.254: v83.5,40.5 84,41 95.36,41 JP2.3
N$39
  Top 0.406: K1.2 24.79,46.46 25.25,46 25.25,42.15 T1.3 | T1.3 D3.A | T1.3 25.1,39.15 LED2.A
N$40
  Bottom 1.422: K1.P0 28.25,66.45 | 28.25,66.45 K1.P1 | X1.2 22,76.5 23.25,75.25 26.75,75.25 28,74 28,66.7 28.25,66.45
N$41
  Top 0.254: IC2.27 58.43,17.32 58.75,17 73.62,17 80.75,24.12 80.75,33.38 84.25,36.88 88.25,36.88 88.88,37.5 88.88,38.88 92.88,42.88 92.88,47 94.38,48.5 95.28,48.5 JP2.6
N$42
  Top 1.422: K1.S0 K1.S1 21.8,71.45 17,76.25 X1.1
N$43  (via drill 0.6)
  Top 0.254: IC2.23 57.38,14.12 57.88,14.38 74.5,14.38 83.12,23 83.12,32.5 84.88,34.25 90.12,34.25 91.62,35.75 91.62,37.38 92.75,38.5 95.31,38.5 JP2.2 | T1.1 21.75,43 19.75,41 19.75,37.25 22,35 80,35 v83.5,38.5
  Bottom 0.254: v83.5,38.5 95.31,38.5 JP2.2
N$44  (via drill 0.6)
  Top 0.254: JP2.4 90.12,38.27 90.12,36.12 89.62,35.62 84.5,35.62 82,33.12 82,23.5 74.25,15.75 56.69,15.75 IC2.25 | T3.1 50,43 49.5,42.5 49.5,37.25 50.75,36 77,36 v83.5,42.5
  Bottom 0.254: v83.5,42.5 91.25,42.5 92.25,43.5 95.36,43.5 JP2.4
N$45
  Top 0.406: LED3.C R19.1
N$46
  Top 0.406: K2.2 38.54,46.46 39,46 39,42.1 T2.3 | T2.3 39.1,39.15 LED3.A | T2.3 D4.A
N$47  (via drill 0.6)
  Top 0.254: JP2.5 95.31,46.12 94.25,46.12 93.38,45.25 93.38,42.62 89.38,38.62 89.38,37 88.75,36.38 84.5,36.38 81.38,33.25 81.38,23.75 74,16.38 58.12,16.38 57.88,16.62 56.77,16.62 IC2.26 | T4.1 65.25,43 64.25,42 64.25,37.25 65,36.5 76.5,36.5 81,41 81,42.25 v83.25,44.5
  Bottom 0.254: 95.31,46 JP2.5 95.19,46.25 92.25,46.25 90.5,44.5 v83.25,44.5
N$48
  Bottom 1.422: K2.P0 42.25,66.45 | 42.25,66.45 K2.P1 | X2.3 40.54,79.21 42,77.75 42,66.7 42.25,66.45
N$49
  Top 1.422: K2.S0 K2.S1 38.19,72.31 35.25,75.25 33,75.25 32,76.25 X2.2
N$50
  Top 0.406: LED4.C R20.1
N$51
  Top 0.406: K3.2 53.29,46.46 54.25,45.5 54.25,42.15 T3.3 | T3.3 54.1,39.15 LED4.A | T3.3 D5.A
N$52  (via drill 0.6)
  Top 0.254: JP3.1 95.96,51.16 97,50.12 97,28 94.62,25.62 84.5,25.62 83.75,24.88 83.75,22.88 74.62,13.75 60.12,13.75 v56.75,10.38 | v48.38,10.25 49.25,11.12 IC2.15
  Bottom 0.254: v56.75,10.38 48.5,10.38 v48.38,10.25
N$53
  Bottom 1.422: K3.P1 57.25,66.45 | 57.25,66.45 K3.P0 | X3.2 67,76.5 66,75.5 57.75,75.5 57,74.75 57,66.7 57.25,66.45
N$54
  Top 0.61: FUSE.2 D2.A
N$55
  Top 1.422: K3.S1 K3.S0 60.68,77.91 X3.1
N$56
  Top 0.406: LED5.C R21.1
N$57
  Top 0.406: K4.2 67.54,46.46 68.25,45.75 68.25,42.15 T4.3 | T4.3 D6.A | T4.3 68.1,39.15 LED5.A
N$58  (via drill 0.6)
  Top 0.61: IC1.6 95.39,19.36 95.75,19 95.75,17 95.5,16.75 86.5,16.75 | 86.5,16.75 84.88,18.38 84.88,21.25 85.5,21.88 87.8,21.88 | 87.8,21.88 IC1.1 | 87.8,21.88 87.8,20.66 IC1.2 | 86.5,16.75 83.5,13.75 83.5,12.25 82.75,11.5 D2.C 80.5,11.55 v80.5,13.25 | C18.+ 65,9.75 v67.25,12
  Bottom 0.61: v67.25,12 68.5,13.25 v80.5,13.25
N$59
  Bottom 1.422: K4.P1 71.25,66.45 | 71.25,66.45 K4.P0 | X4.3 82,76.5 80.75,75.25 71.5,75.25 71,74.75 71,66.7 71.25,66.45
N$60
  Top 1.422: K4.S1 K4.S0 74.68,73.93 77,76.25 X4.2
N$61
  Top 0.813: IC1.7 96.61,20.64 97,20.25 97,15.75 96.25,15 95.52,15 L1.2
N$62
  Top 0.254: 0,9 9,9 9,0 90,0 90,9 99,9 99,75 90,75 90,84 9,84 9,75 0,75 0,9
N$63  (via drill 0.6)
  Top 0.406: v88.12,15 88.38,14.75 R16.2 C11.2 R15.1 | v86.12,19.38 87.82,19.38 IC1.3
  Bottom 0.406: v88.12,15 88.12,17.38 v86.12,19.38
N$64
  Top 0.254: R1.1 LED1.A

### Text on the board
Top: (c) 2013 | microelemente.ro | A | B